# Altium schematic sheet Sheet6.SchDoc
size A4
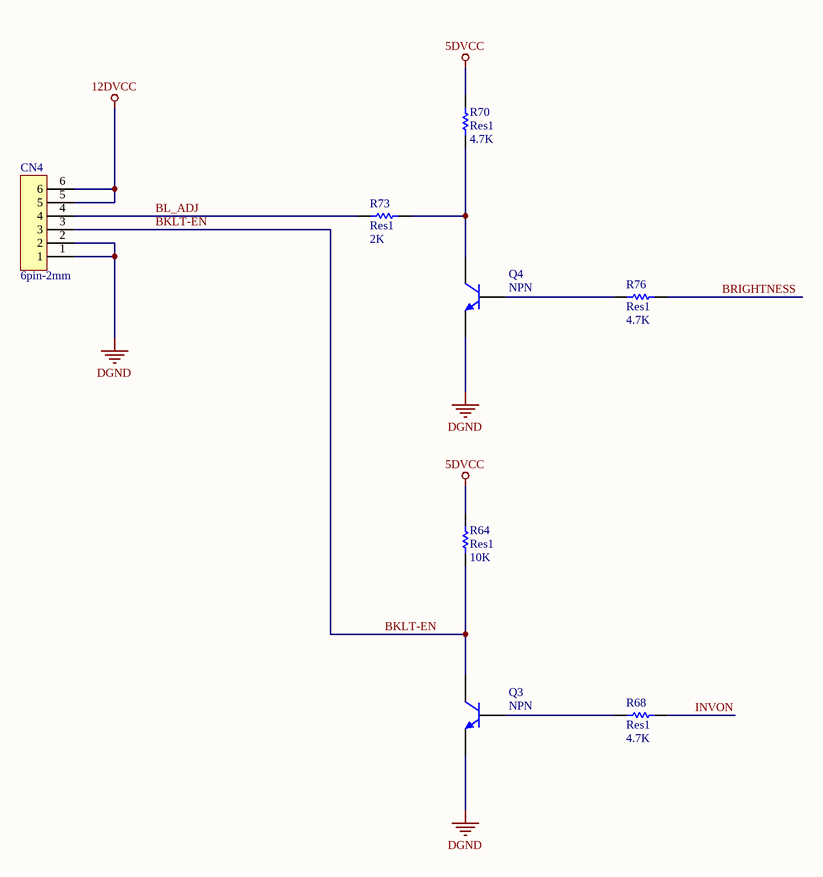
[diagram p0: Sheet6.SchDoc]

## Parts
CN4  6pin-2mm  [JP-6]
Q3  NPN  [Q-SOT23]
Q4  NPN  [Q-SOT23]
R64  Res1  value 10K  [R-0603]
R68  Res1  value 4.7K  [R-0603]
R70  Res1  value 4.7K  [R-0603]
R73  Res1  value 2K  [R-0603]
R76  Res1  value 4.7K  [R-0603]

## Nets
5DVCC: R64.2 R70.2
12DVCC: CN4.5 CN4.6
DGND: CN4.1 CN4.2 Q3.3(E) Q4.3(E)
BKLT-EN: CN4.3 Q3.1(C) R64.1
BL_ADJ: CN4.4 R73.1
BRIGHTNESS: R76.2
INVON: R68.2
NetQ3_2: Q3.2(B) R68.1
NetQ4_1: Q4.1(C) R70.1 R73.2
NetQ4_2: Q4.2(B) R76.1

## Library data of the parts
Q3 Q4 = NPN: NPN Bipolar Transistor; Published: 8-Jun-2000; LatestRevisionDate: 17-Jul-2002; LatestRevisionNote: Re-released for DXP Platform.; PackageReference: TO-226-AA; Publisher: Altium Limited; PackageDescription: TO, Flat Index; 3 In-Line, Axial Leads; Body Dia. 4.8mm; Leads 0.55 x 0.51 mm (max); Code_JEDEC: TO-226-AA
R64 R68 R70 R73 R76 = Res1: Resistor; Published: 8-Jun-2000; LatestRevisionDate: 17-Jul-2002; LatestRevisionNote: Re-released for DXP Platform.; PackageReference: AXIAL-0.3; Publisher: Altium Limited; PackageDescription: Axial Device, Thru-Hole; 2 Leads; 0.3 in Pin Spacing